# EAGLE design Display (EAGLE 8.6.2)
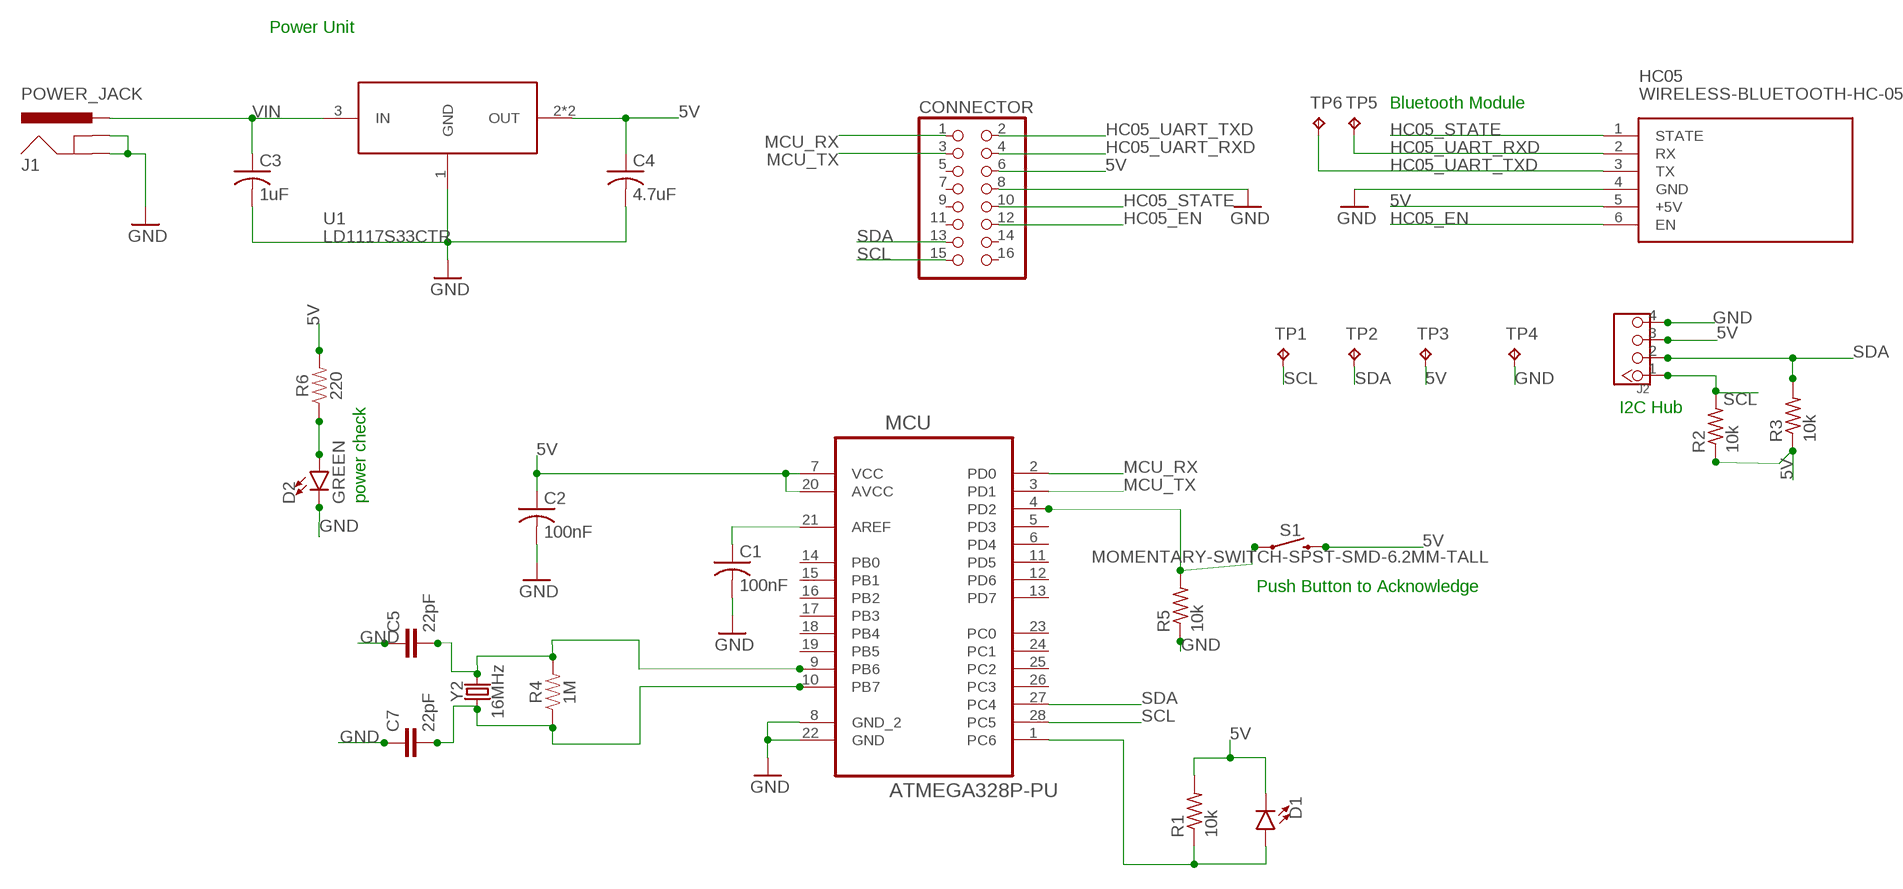
[diagram p0: schematic, sheet 1]

## Parts
C1  100nF  C-USC0603  [C0603]
C2  100nF  C-USC0603  [C0603]
C3  1uF  C-USC0603  [C0603]
C4  4.7uF  C-USC0603  [C0603]
C5  22pF  22PF-0603-50V-5%  [0603]
C7  22pF  22PF-0603-50V-5%  [0603]
CONNECTOR  PINHD-2X8  [2X08]
D1  LED1206  [LED-1206]
D2  GREEN  LED-GREEN1206  [LED-1206]
HC05  WIRELESS-BLUETOOTH-HC-05  [WIRELESS-BLUETOOTH-HC-05]
J1  POWER_JACK  [POWER_JACK_PTH]
J2  TWIG-4P-2.0  [4P-2.0-W/O-BUCKLE]
MCU  ATMEGA328P-PU  [DIP254P762X457-28]
R1  10k  R-US_R0603  [R0603]
R2  10k  R-US_R0603  [R0603]
R3  10k  R-US_R0603  [R0603]
R4  1M  1MOHM-0603-1/4W-5%  [0603]
R5  10k  R-US_R0603  [R0603]
R6  220  220OHM-0603-1/10W-1%  [0603]
S1  MOMENTARY-SWITCH-SPST-SMD-6.2MM-TALL  [TACTILE_SWITCH_SMD_6.2MM_TALL]
TP1  TPTP20R  [TP20R]
TP2  TPTP20R  [TP20R]
TP3  TPTP20R  [TP20R]
TP4  TPTP20R  [TP20R]
TP5  TPTP20R  [TP20R]
TP6  TPTP20R  [TP20R]
U1  LD1117S33CTR  [SOT223]
Y2  16MHz  CRYSTAL-16MHZPTH-HC49US  [HC49US]

## Nets
5V [5V]: C2.1 C4.1 CONNECTOR.6 D1.C HC05.5(+5V) J2.3 MCU.7(VCC) MCU.20(AVCC) R1.2 R2.1 R3.1 R6.2 S1.B2 TP3.TP U1.2(OUT) U1.4(OUT)
GND [ground]: C1.2 C2.2 C3.2 C4.2 C5.1 C7.1 CONNECTOR.8 D2.C HC05.4(GND) J1.GND J1.GNDBREAK J2.4 MCU.8(GND_2) MCU.22(GND) R5.1 TP4.TP U1.1(GND)
HC05_EN: CONNECTOR.12 HC05.6(EN)
HC05_STATE: CONNECTOR.10 HC05.1(STATE)
HC05_UART_RXD: CONNECTOR.4 HC05.2(RX) TP5.TP
HC05_UART_TXD: CONNECTOR.2 HC05.3(TX) TP6.TP
MCU_RX: CONNECTOR.1 MCU.2(PD0)
MCU_TX: CONNECTOR.3 MCU.3(PD1)
N$1: C5.2 MCU.9(PB6) R4.2 Y2.2
N$2: C1.1 MCU.21(AREF)
N$3: C7.2 MCU.10(PB7) R4.1 Y2.1
N$4: D1.A MCU.1(PC6) R1.1
N$5: MCU.4(PD2) R5.2 S1.A2
N$6: D2.A R6.1
SCL: CONNECTOR.15 J2.1 MCU.28(PC5) R2.2 TP1.TP
SDA: CONNECTOR.13 J2.2 MCU.27(PC4) R3.2 TP2.TP
VIN: C3.1 J1.PWR U1.3(IN)
Unconnected: CONNECTOR.5 CONNECTOR.7 CONNECTOR.9 CONNECTOR.11 CONNECTOR.14 CONNECTOR.16 MCU.5(PD3) MCU.6(PD4) MCU.11(PD5) MCU.12(PD6) MCU.13(PD7) MCU.14(PB0) MCU.15(PB1) MCU.16(PB2) MCU.17(PB3) MCU.18(PB4) MCU.19(PB5) MCU.23(PC0) MCU.24(PC1) MCU.25(PC2) MCU.26(PC3)

## Notes on the sheet
- Power Unit
- Bluetooth Module
- I2C Hub
- power check
- Push Button to Acknowledge

## Library data of the parts
C1-C4 = rcl:C-US: CAPACITOR, American symbol; SPICEPREFIX: C
C5 C7 = SparkFun-Capacitors:22PF: 22pF ceramic capacitors A capacitor is a passive two-terminal electrical component used to store electrical energy temporarily in an electric field.; PROD_ID: CAP-07876
CONNECTOR = pinhead:PINHD-2X8: PIN HEADER
D1 = SparkFun-LED:LED: LED (Generic) Standard schematic elements and footprints for 5mm, 3mm, 1206, and 0603 sized LEDs. Generic LEDs with no color specified.
D2 = SparkFun-LED:LED-GREEN: Green SMD LED Used in manufacturing of various products at SparkFun Packages: 0603 - SMD 0603 package [Product Link] <http://www.futureelectronics.com/en/technologies/semiconductors/optoelectronics/leds/Pages/9894312-LTST-C190GKT.aspx?CrossPart=HSMG-C190&IM=0> LilyPad 1206 - SMD1206 LilyPad package [Product Link] <http://www.futureelectronics.com/en/Technologies/Product.aspx?ProductID=IN150NGHARVATEKCORPORATION2049943&IM=0> 1206 - SMD1206 package [Product Link] <http://www.futureelectronics.com/en/technologies/semiconductors/optoelectronics/leds/Pages/8315665-LTST-C150KGKT.aspx?IM=0> 1206 Bottom Mount -SMD 1206 Bottom Mount [Product Link] <http://www.digikey.com/product-detail/en/lite-on-inc/LTST-C230KGKT/160-1456-1-ND/386854> SparkFun Products: Pro Mini 328 -5V <https://www.sparkfun.com/products/821> RedBoard <https://www.sparkfun.com/products/12757> MP3 Trigger <https://www.sparkfun.com/products/13720> Makey Makey <https://www.sparkfun.com/products/11076>; PROD_ID: DIO-00862
HC05 = diy-modules:WIRELESS-BLUETOOTH-HC-05: Bluetooth Transceiver Module based on HC-05 board Tutorial is available here: https://arduino-info.wikispaces.com/BlueTooth-HC05-HC06-Modules-How-To Click here to find device on ebay.com <http://www.ebay.com/sch/hc-05+module+rs232>
J1 = SparkFun-Connectors:POWER_JACK: Power Jack Connector This is the standard 5.5mm barrel jack for power. The PTH is the most common, proven, reliable, footprint. The Slot footprint only works if the mill layer is transmitted to the PCB fab house so be warned. Here are the connectors we sell at SparkFun: DC Barrel Power Jack/Connector <https://www.sparkfun.com/products/119> (PRT-00119) DC Barrel Power Jack/Connector (SMD) <https://www.sparkfun.com/products/12748> (PRT-12748) DC Barrel Jack Adapter - Breadboard Compatible <https://www.sparkfun.com/products/10811> (PRT-10811) It is used on this SparkFun product (and many, many others): SparkFun RedBoard - Programmed with Arduino <https://www.sparkfun.com/products/12757> (DEV-12757) Also, if you need a mating power supply or connector, please check these out: Wall Adapter Power Supply - 9VDC 650mA <https://www.sparkfun.com/products/298> (TOL-00298) DC Barrel Jack Adapter - Male <https://www.sparkfun.com/products/10287> (PRT-10287); PROD_ID: CONN-08197
J2 = Connector:TWIG-4P-2.0
MCU = Atmel_By_element14_Batch_1-00:ATMEGA328P-PU: 8-bit Microcontroller with In-System Programmable Flash; MPN: ATMEGA328P-PU; OC_FARNELL: 1715487; OC_NEWARK: 15R0268; PACKAGE: PDIP-28; SUPPLIER: Atmel
R1-R3 R5 = rcl:R-US_: RESISTOR, American symbol; SPICEPREFIX: R
R4 = SparkFun-Resistors:1MOHM: 1MΩ resistor A resistor is a passive two-terminal electrical component that implements electrical resistance as a circuit element. Resistors act to reduce current flow, and, at the same time, act to lower voltage levels within circuits. - Wikipedia; PROD_ID: RES-07868
R6 = SparkFun-Resistors:220OHM: 220Ω resistor A resistor is a passive two-terminal electrical component that implements electrical resistance as a circuit element. Resistors act to reduce current flow, and, at the same time, act to lower voltage levels within circuits. - Wikipedia; PROD_ID: RES-07861
S1 = SparkFun-Switches:MOMENTARY-SWITCH-SPST: Momentary Switch (Pushbutton) - SPST Normally-open (NO) SPST momentary switches (buttons, pushbuttons). Variants PTH-12MM - 12mm square, through-hole Momentary Pushbutton Switch - 12mm Square <https://www.sparkfun.com/products/9190> (COM-09190) PTH-6.0MM, PTH-6.0MM-KIT - 6.0mm square, through-hole Mini Pushbutton Switch <https://www.sparkfun.com/products/97> (COM-00097) KIT package intended for soldering kit's - only one side of pads' copper is exposed. PTH-RIGHT-ANGLE-KIT - Right-angle, through-hole Right Angle Tactile Button <https://www.sparkfun.com/products/10791> - Used on SparkFun BigTime Watch Kit <https://www.sparkfun.com/products/11734> SMD-12MM - 12mm square, surface-mount Tactile Button - SMD (12mm) <https://www.sparkfun.com/products/12993> (COM-12993) Used on SparkFun PicoBoard <https://www.sparkfun.com/products/11888> SMD-4.5MM - 4.5mm Square Trackball Switch Used on SparkFun Blackberry Trackballer Breakout <https://www.sparkfun.com/products/13169> SMD-4.6MMX2.8MM - 4.60mm x 2.80mm, surface mount Used on SparkFun SAMD21 Mini Breakout <https://www.sparkfun.com/products/13664> SMD-5.2MM, SMD-5.2-REDUNDANT - 5.2mm square, surface-mount Mini Pushbutton Switch - SMD <https://www.sparkfun.com/products/8720> (COM-08720) Used on Arduino Pro Mini <https://www.sparkfun.com/products/11114> REDUNDANT package connects both switch circuits together SMD-6.0X3.5MM - 6.0 x 3.5mm, surface mount Momentary Reset Switch SMD <https://www.sparkfun.com/products/8229> (COM-08229) SMD-6.2MM-TALL - 6.2mm square, surface mount Tactile Button - SMD (6mm) <https://www.sparkfun.com/products/12992> Used on SparkFun Digital Sandbox <https://www.sparkfun.com/products/12651> SMD-RIGHT-ANGLE - Right-angle, surface mount Used on SparkFun Block for Intel® Edison - Arduino <https://www.sparkfun.com/products/13036>; PROD_ID: SWCH-11966; SF_SKU: COM-12992
TP1-TP6 = testpad:TP: Test pad
U1 = LD1117S33CTR:LD1117S33CTR: http://octopart.com/ld1117s33tr-stmicroelectronics-526708; AVAILABILITY: Good; DESCRIPTION: LD1117 Series 1300 mA 3.3 V Fixed Output Positive Voltage LDO Regulator- SOT-223; MF: STMicroelectronics; MP: LD1117S33CTR; PACKAGE: SOT-223 STMicroelectronics; PRICE: 0.19 USD
Y2 = SparkFun-Clocks:CRYSTAL-16MHZ: 16MHz Crystal Digikey Example <http://www.digikey.com/product-search/en?keywords=535-9122-1-ND> Frequency: 16MHz Frequency Stability: ±50ppm Frequency Tolerance: ±20ppm Load Capacitance: 18pF SparkFun Products: Pro Micro -5V/16MHz <https://www.sparkfun.com/products/12640> SparkFun Serial Enabled LCD Kit <https://www.sparkfun.com/products/10097>; PROD_ID: XTAL-08181; SF_ID: COM-00536

## Net classes
0 default: width 0.33 mm, drill 0.559 mm, clearance 0.254 mm
1 ground: width 0.381 mm, drill 0.254 mm, clearance 0.254 mm
2 5V: width 0.381 mm, drill 0.254 mm, clearance 0.254 mm

## Board
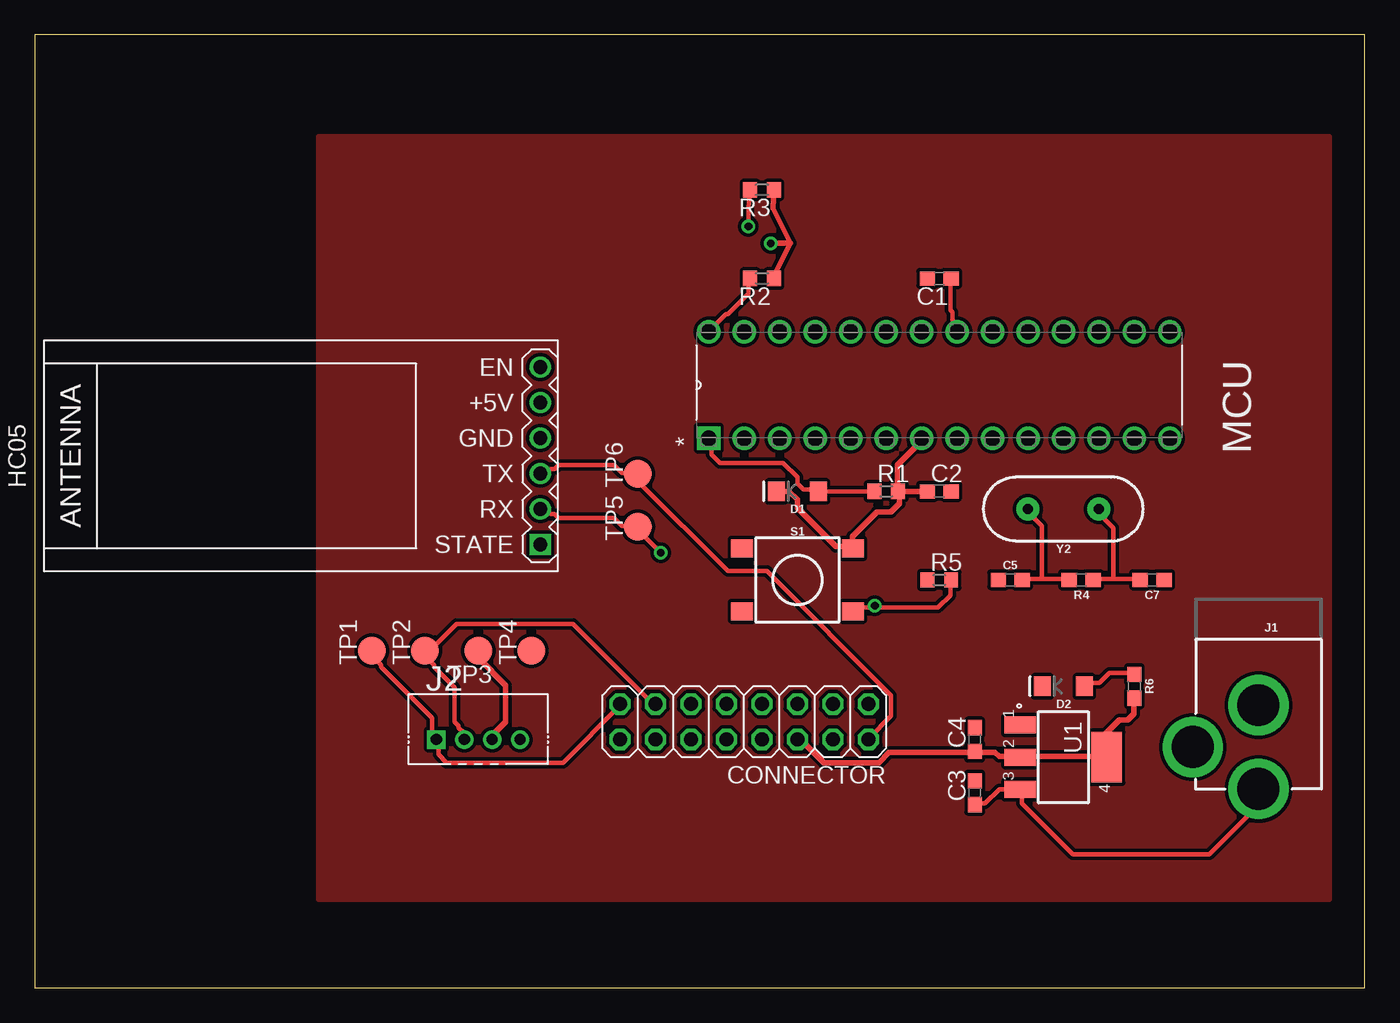
[diagram p1: board, top side]
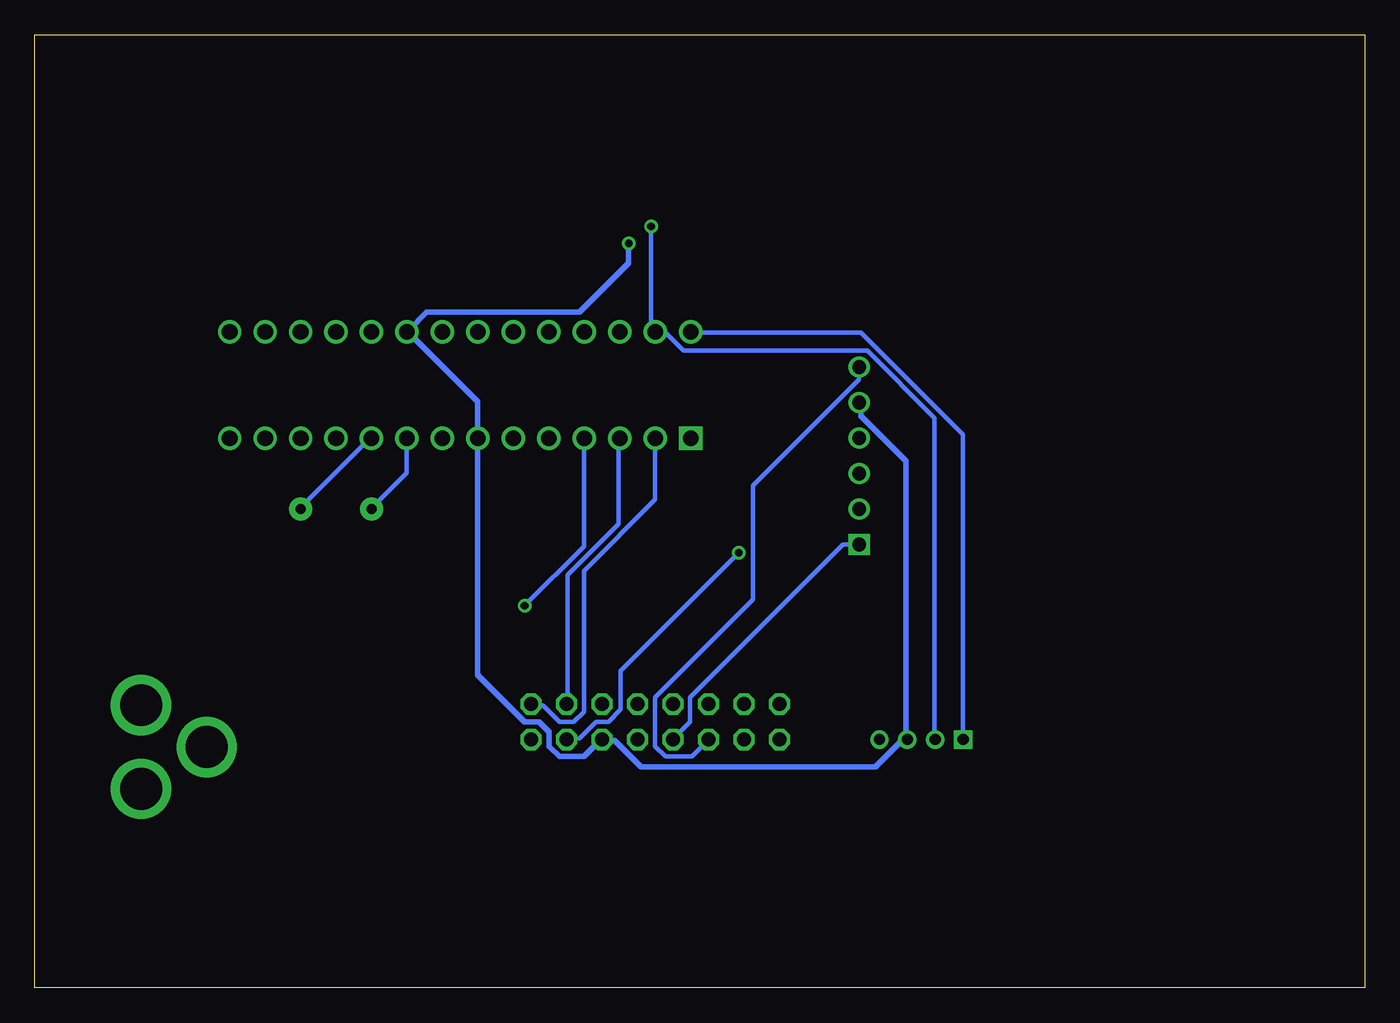
[diagram p2: board, bottom side, seen from below]

Size 95.23 x 68.25 mm. Coordinates in mm from the lower left corner, seen from the top.
Outline: 0,0 95.23,0 95.23,68.25 0,68.25 0,0
Copper layers (1*16): Top 0.035mm / dielectric 1.5mm / Bottom 0.035mm
Design rules "default": minimum track width 6mil, minimum drill 0.35mm, track to track 6mil, track to pad 6mil, pad to pad 6mil, via to via 6mil, smd to smd 6mil, copper to edge 40mil, drill to drill 6mil, minimum pad ring 10mil, minimum via ring 8mil, stop-mask expansion 4mil, vias tented up to drill 0mil, thermal gap 10mil

### Footprints (pad centres in the part's own frame; a part is rotated, then mirrored left to right if it is on the bottom)
C0603 = smd 1.1 x 1: 1 -0.85,0; 2 0.85,0
0603 = smd 1.1 x 1: 1 -0.85,0; 2 0.85,0
2X08 = drill 1.016 octagon: 1 -8.89,-1.27; 2 -8.89,1.27; 3 -6.35,-1.27; 4 -6.35,1.27; 5 -3.81,-1.27; 6 -3.81,1.27; 7 -1.27,-1.27; 8 -1.27,1.27; 9 1.27,-1.27; 10 1.27,1.27; 11 3.81,-1.27; 12 3.81,1.27; 13 6.35,-1.27; 14 6.35,1.27; 15 8.89,-1.27; 16 8.89,1.27
LED-1206 = smd 1.2 x 1.4: A -1.5,0; C 1.5,0
WIRELESS-BLUETOOTH-HC-05 = drill 1 square: 1 -6.35,-17.145 | drill 1: 2 -3.81,-17.145; 3 -1.27,-17.145; 4 1.27,-17.145; 5 3.81,-17.145; 6 6.35,-17.145
POWER_JACK_PTH = drill 2.997 pad 4.318: GND 0,7.7; GNDBREAK 4.7,10.7; PWR 0,13.7
4P-2.0-W/O-BUCKLE = drill 0.8 pad 1.27 square: 1 -3,0 | drill 0.8 pad 1.27: 2 -1,0; 3 1,0; 4 3,0
DIP254P762X457-28 = drill 1.118 square: 1 -7.62,33.02 | drill 1.118: 2 -7.62,30.48; 3 -7.62,27.94; 4 -7.62,25.4; 5 -7.62,22.86; 6 -7.62,20.32; 7 -7.62,17.78; 8 -7.62,15.24; 9 -7.62,12.7; 10 -7.62,10.16; 11 -7.62,7.62; 12 -7.62,5.08; 13 -7.62,2.54; 14 -7.62,0; 15 0,0; 16 0,2.54; 17 0,5.08; 18 0,7.62; 19 0,10.16; 20 0,12.7; 21 0,15.24; 22 0,17.78; 23 0,20.32; 24 0,22.86; 25 0,25.4; 26 0,27.94; 27 0,30.48; 28 0,33.02
R0603 = smd 1 x 1.1: 1 -0.85,0; 2 0.85,0
TACTILE_SWITCH_SMD_6.2MM_TALL = smd 1.55 x 1.3: A1 -3.975,-2.25; A2 3.975,-2.25; B1 -3.975,2.25; B2 3.975,2.25
TP20R = smd 2 x 2: TP 0,0
SOT223 = smd 2.235 x 1.219: 1 -3.099,2.311; 2 -3.099,0; 3 -3.099,-2.311 | smd 2.2 x 3.6: 4 3.099,0
HC49US = drill 0.7 pad 1.651: 1 -2.54,0; 2 2.54,0

### Placement (x,y rotation side)
C1  64.77,50.8 180 top
C2  64.77,35.56 0 top
C3  67.31,13.97 90 top
C4  67.31,17.78 90 top
C5  69.85,29.21 0 top
C7  80.01,29.21 180 top
CONNECTOR  50.8,19.05 180 top
D1  54.61,35.56 180 top
D2  73.66,21.59 180 top
HC05  19.05,38.1 90 top
J1  87.63,27.94 180 top
J2  31.75,17.78 0 top
MCU  81.28,46.99 90 top
R1  60.96,35.56 0 top
R2  52.07,50.8 180 top
R3  52.07,57.15 180 top
R4  74.93,29.21 180 top
R5  64.77,29.21 0 top
R6  78.74,21.59 270 top
S1  54.61,29.21 0 top
TP1  24.13,24.13 90 top
TP2  27.94,24.13 90 top
TP3  31.75,24.13 180 top
TP4  35.56,24.13 90 top
TP5  43.18,33.02 90 top
TP6  43.18,36.83 90 top
U1  73.66,16.51 0 top
Y2  73.66,34.29 180 top

### Tracks (layer width: path | path; a pad name or v marks a point on that pad's centre or on a via)
5V  (via drill 0.56)
  Top 0.381: D1.C 53.14,35.55 54.02,35.55 54.6,34.96 54.6,34.38 57.38,31.6 58.55,31.6 S1.B2 58.55,31.75 58.55,32.33 60.3,34.09 61.32,34.09 61.91,34.67 61.91,35.4 R1.2 | C2.1 63.81,35.55 61.91,35.55 R1.2 | R1.2 61.76,35.69 61.76,37.45 63.37,39.05 63.37,39.34 MCU.7 | 54.12,53.32 52.85,55.85 R3.1 | 54.12,53.32 52.85,50.88 R2.1 | v52.7,53.32 54.12,53.32 | R6.2 78.7,20.65 78.7,19.63 78.26,19.19 77.68,19.19 76.66,18.17 76.66,16.56 U1.4 76.51,16.56 70.67,16.56 U1.2 70.52,16.56 69.06,16.56 68.77,16.85 67.31,16.85 C4.1 67.16,16.85 61.18,16.85 60.45,16.12 56.5,16.12 54.75,17.88 CONNECTOR.6 | TP3.TP 31.82,24.01 31.82,23.57 33.72,21.67 33.72,19.04 32.84,18.17 32.84,17.88 J2.3
  Bottom 0.381: v52.7,53.32 52.7,51.91 56.21,48.4 67.16,48.4 68.48,47.08 MCU.20 68.48,46.94 63.51,41.97 63.51,39.49 MCU.7 63.51,39.2 63.51,22.4 60.15,19.04 59.13,19.04 58.4,18.31 58.4,17.29 57.67,16.56 55.92,16.56 54.75,17.73 CONNECTOR.6 54.6,17.73 53.73,17.73 51.83,15.83 35.03,15.83 32.99,17.88 J2.3 32.84,17.88 32.84,37.74 36.05,40.95 36.05,41.83 HC05.5
HC05_EN
  Bottom 0.33: HC05.6 36.2,44.31 36.2,43.58 43.8,35.98 43.8,27.81 50.81,20.8 50.81,17.29 50.08,16.56 48.18,16.56 47.01,17.73 CONNECTOR.12
HC05_STATE
  Bottom 0.33: HC05.1 37.37,31.75 48.32,20.8 48.32,19.04 49.49,17.88 CONNECTOR.10
HC05_UART_RXD  (via drill 0.56)
  Top 0.33: HC05.2 36.2,34.23 36.64,34.23 36.93,33.94 37.22,33.94 37.52,33.65 41.46,33.65 42.04,33.06 43.07,33.06 TP5.TP 43.07,32.92 v44.82,31.17
  Bottom 0.33: v44.82,31.17 53.29,22.7 53.29,19.92 54.17,19.04 55.04,19.04 56.21,17.88 57.09,17.88 CONNECTOR.4
HC05_UART_TXD
  Top 0.33: HC05.3 36.2,36.86 36.64,36.86 36.93,37.15 37.22,37.15 37.52,37.45 41.46,37.45 42.04,36.86 43.07,36.86 TP6.TP 43.21,36.72 43.21,36.28 49.64,29.85 52.41,29.85 61.32,20.94 61.32,19.48 59.72,17.88 CONNECTOR.2
MCU_RX
  Bottom 0.33: CONNECTOR.1 59.57,20.21 58.84,20.21 57.67,19.04 56.65,19.04 55.92,19.77 55.92,29.85 50.81,34.96 50.81,39.34 MCU.2
MCU_TX
  Bottom 0.33: CONNECTOR.3 57.09,20.36 57.09,29.56 53.44,33.21 53.44,39.34 MCU.3
N$1
  Top 0.33: 72.13,29.27 70.81,29.27 C5.2 | 72.13,29.27 74.03,29.27 R4.2 | 72.13,29.27 72.13,33.06 71.25,33.94 71.25,34.23 Y2.2
  Bottom 0.33: MCU.9 68.62,39.34 68.62,36.86 71.11,34.38 Y2.2
N$2
  Top 0.33: C1.1 65.56,50.74 65.56,48.55 65.7,48.4 65.7,47.81 66,47.52 66,47.08 MCU.21
N$3
  Top 0.33: 77.24,29.27 75.78,29.27 R4.1 | 77.24,29.27 79.14,29.27 C7.2 | 77.24,29.27 77.24,32.92 76.22,33.94 76.22,34.23 Y2.1
  Bottom 0.33: MCU.10 71.25,39.34 76.22,34.38 Y2.1
N$4
  Top 0.33: R1.1 60.01,35.55 56.21,35.55 D1.A 56.06,35.69 55.04,35.69 54.6,36.13 54.6,36.57 53.58,37.59 49.05,37.59 48.47,38.18 48.47,39.2 48.32,39.34 MCU.1
N$5  (via drill 0.56)
  Top 0.33: 60.15,27.22 58.84,27.22 58.69,27.08 S1.A2 | 60.15,27.22 64.68,27.22 65.56,28.1 65.56,29.12 R5.2 | v60.15,27.37 60.15,27.22
  Bottom 0.33: v60.15,27.37 55.92,31.6 55.92,39.34 MCU.4
N$6
  Top 0.33: R6.1 78.7,22.55 76.95,22.55 76.22,21.82 75.34,21.82 75.2,21.67 D2.A
N$7
  pour Top: 20.32,60.96 92.71,60.96 92.71,6.35 20.32,6.35
SCL
  Top 0.33: R2.2 51.1,50.74 51.1,49.71 49.64,48.25 49.49,48.25 48.32,47.08 MCU.28 | TP1.TP 24.23,24.01 24.23,23.72 24.81,23.13 24.81,22.99 28.46,19.34 28.46,18.02 28.61,17.88 J2.1 28.9,17.73 28.9,16.71 29.48,16.12 37.81,16.12 41.9,20.21 CONNECTOR.15
  Bottom 0.33: MCU.28 48.18,46.94 36.05,46.94 28.75,39.64 28.75,17.88 J2.1
SDA  (via drill 0.56)
  Top 0.33: v51.1,54.53 51.1,55.85 R3.2 | J2.2 30.65,17.88 30.65,18.31 30.36,18.61 30.36,18.75 30.07,19.04 30.07,21.53 28.61,22.99 28.61,23.13 28.02,23.72 28.02,24.01 TP2.TP 28.17,24.01 30.21,26.05 38.54,26.05 43.94,20.65 44.09,20.65 44.38,20.36 CONNECTOR.13
  Bottom 0.33: v51.1,54.53 51.1,47.38 50.81,47.08 MCU.27 50.66,46.94 50.08,46.94 48.76,45.62 35.62,45.62 30.8,40.8 30.8,17.88 J2.2
VIN
  Top 0.33: C3.1 67.31,13.2 68.04,13.2 69.06,14.22 70.52,14.22 U1.3 70.67,14.08 70.67,13.2 74.32,9.55 84.11,9.55 87.61,13.06 87.61,14.22 J1.PWR